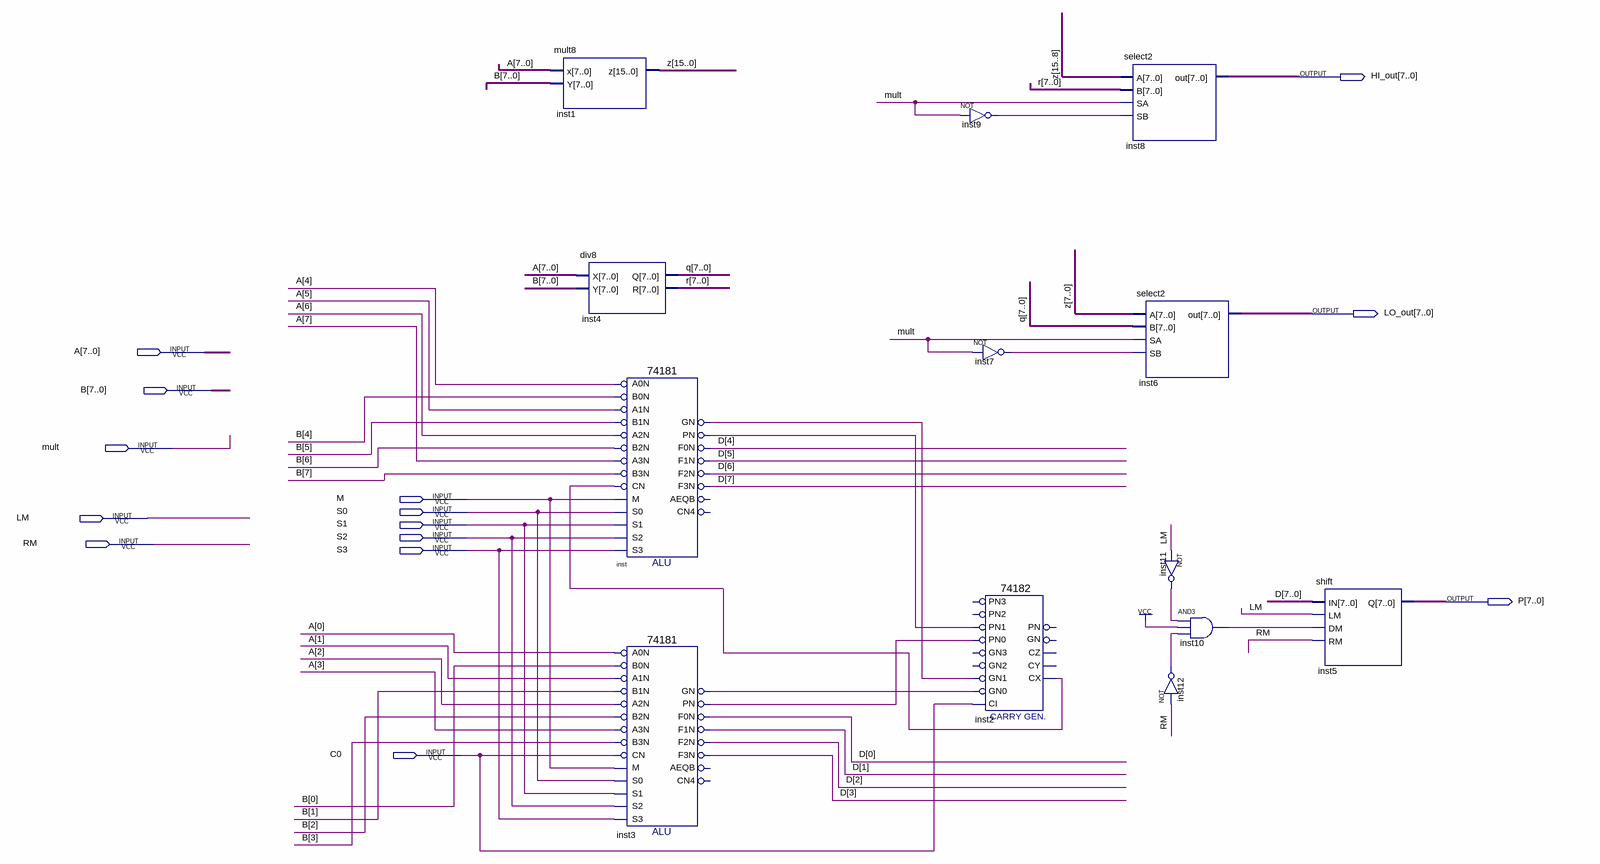
[diagram p0: schematic sheet]
// Quartus schematic alu.bdf as structural Verilog: 13 symbols, 14 pins
module alu (
  input  [7:0] A,
  input  [7:0] B,
  input  mult,
  input  M,
  input  S0,
  input  LM,
  input  S1,
  input  S2,
  input  RM,
  input  S3,
  input  C0,
  output [7:0] HI_out,
  output [7:0] LO_out,
  output [7:0] P
);

  wire inst2_cx, inst3_gn, inst3_pn, inst7_out, inst9_out, inst10_out, inst11_out, inst12_out, inst_gn,
       inst_pn;
  wire [7:0] D, q, r;
  wire [15:0] z;

  mult8 inst1 (.x(A), .Y(B), .z(z));
  div8 inst4 (.X(A), .Y(B), .Q(q), .R(r));
  \74181  inst (
    .B0N(B[4]), .A0N(A[4]), .A1N(A[5]), .B1N(B[5]), .A3N(A[7]), .B2N(B[6]), .A2N(A[6]), .M(M), .CN(inst2_cx),
    .B3N(B[7]), .S2(S2), .S1(S1), .S0(S0), .S3(S3), .PN(inst_pn), .GN(inst_gn), .F3N(D[7]), .F1N(D[5]),
    .F0N(D[4]), .F2N(D[6]));  // open: AEQB, CN4
  \74181  inst3 (
    .B0N(B[0]), .A0N(A[0]), .A1N(A[1]), .B1N(B[1]), .A3N(A[3]), .B2N(B[2]), .A2N(A[2]), .M(M), .CN(C0),
    .B3N(B[3]), .S2(S2), .S1(S1), .S0(S0), .S3(S3), .PN(inst3_pn), .GN(inst3_gn), .F3N(D[3]), .F1N(D[1]),
    .F0N(D[0]), .F2N(D[2]));  // open: AEQB, CN4
  not inst9 (inst9_out, mult);
  not inst7 (inst7_out, mult);
  \74182  inst2 (
    .CI(C0), .PN1(inst_pn), .PN0(inst3_pn), .GN1(inst_gn), .GN0(inst3_gn), .CX(inst2_cx));  // open: PN2, GN2, GN3, PN3, CY, PN, CZ, GN
  select2 inst8 (.A(z[15:8]), .B(r), .SA(mult), .SB(inst9_out), .out(HI_out));
  select2 inst6 (.A(z[7:0]), .B(q), .SA(mult), .SB(inst7_out), .out(LO_out));
  not inst11 (inst11_out, LM);
  not inst12 (inst12_out, RM);
  and inst10 (inst10_out, inst11_out, 1'b1, inst12_out);
  shift inst5 (.IN(D), .LM(LM), .DM(inst10_out), .RM(RM), .Q(P));
endmodule
